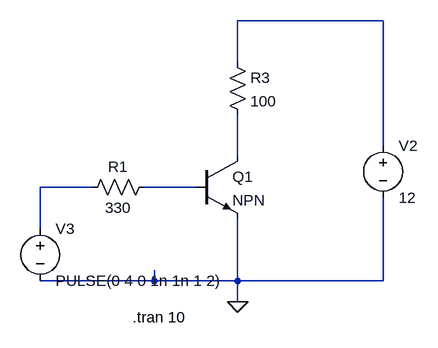
[diagram p0: schematic npn.asc]
npn.asc, the LTspice schematic file:
Version 4
SHEET 1 880 728
WIRE 480 256 256 256
WIRE 256 320 256 256
WIRE 480 448 480 256
WIRE 256 464 256 400
WIRE 32 512 -48 512
WIRE 192 512 112 512
WIRE -48 576 -48 512
WIRE 128 656 128 640
WIRE 128 656 -48 656
WIRE 256 656 256 560
WIRE 256 656 128 656
WIRE 480 656 480 528
WIRE 480 656 256 656
WIRE 256 688 256 656
FLAG 256 688 0
SYMBOL npn 192 464 R0
SYMATTR InstName Q1
SYMBOL res 240 304 R0
SYMATTR InstName R3
SYMATTR Value 100
SYMBOL voltage 480 432 R0
WINDOW 123 0 0 Left 0
WINDOW 39 0 0 Left 0
SYMATTR InstName V2
SYMATTR Value 12
SYMBOL voltage -48 560 R0
WINDOW 123 0 0 Left 0
WINDOW 39 0 0 Left 0
SYMATTR InstName V3
SYMATTR Value PULSE(0 4 0 1n 1n 1 2)
SYMBOL res 128 496 R90
WINDOW 0 0 56 VBottom 2
WINDOW 3 32 56 VTop 2
SYMATTR InstName R1
SYMATTR Value 330
TEXT 94 712 Left 2 !.tran 10

The netlist it stands for:
* npn.asc
Q1 N002 N004 0 0 NPN
R3 N001 N002 100
V2 N001 0 12
V3 N003 0 PULSE(0 4 0 1n 1n 1 2)
R1 N004 N003 330
.model NPN NPN
.model PNP PNP
.lib standard.bjt
.tran 10
.backanno
.end